# Altium project TMDX654GPEVM.PrjPcb (part 4 of 24)

## Sheet 17-eMMC FLASH_SDCARD INTERFACE.SchDoc
size 513 x 386 mm
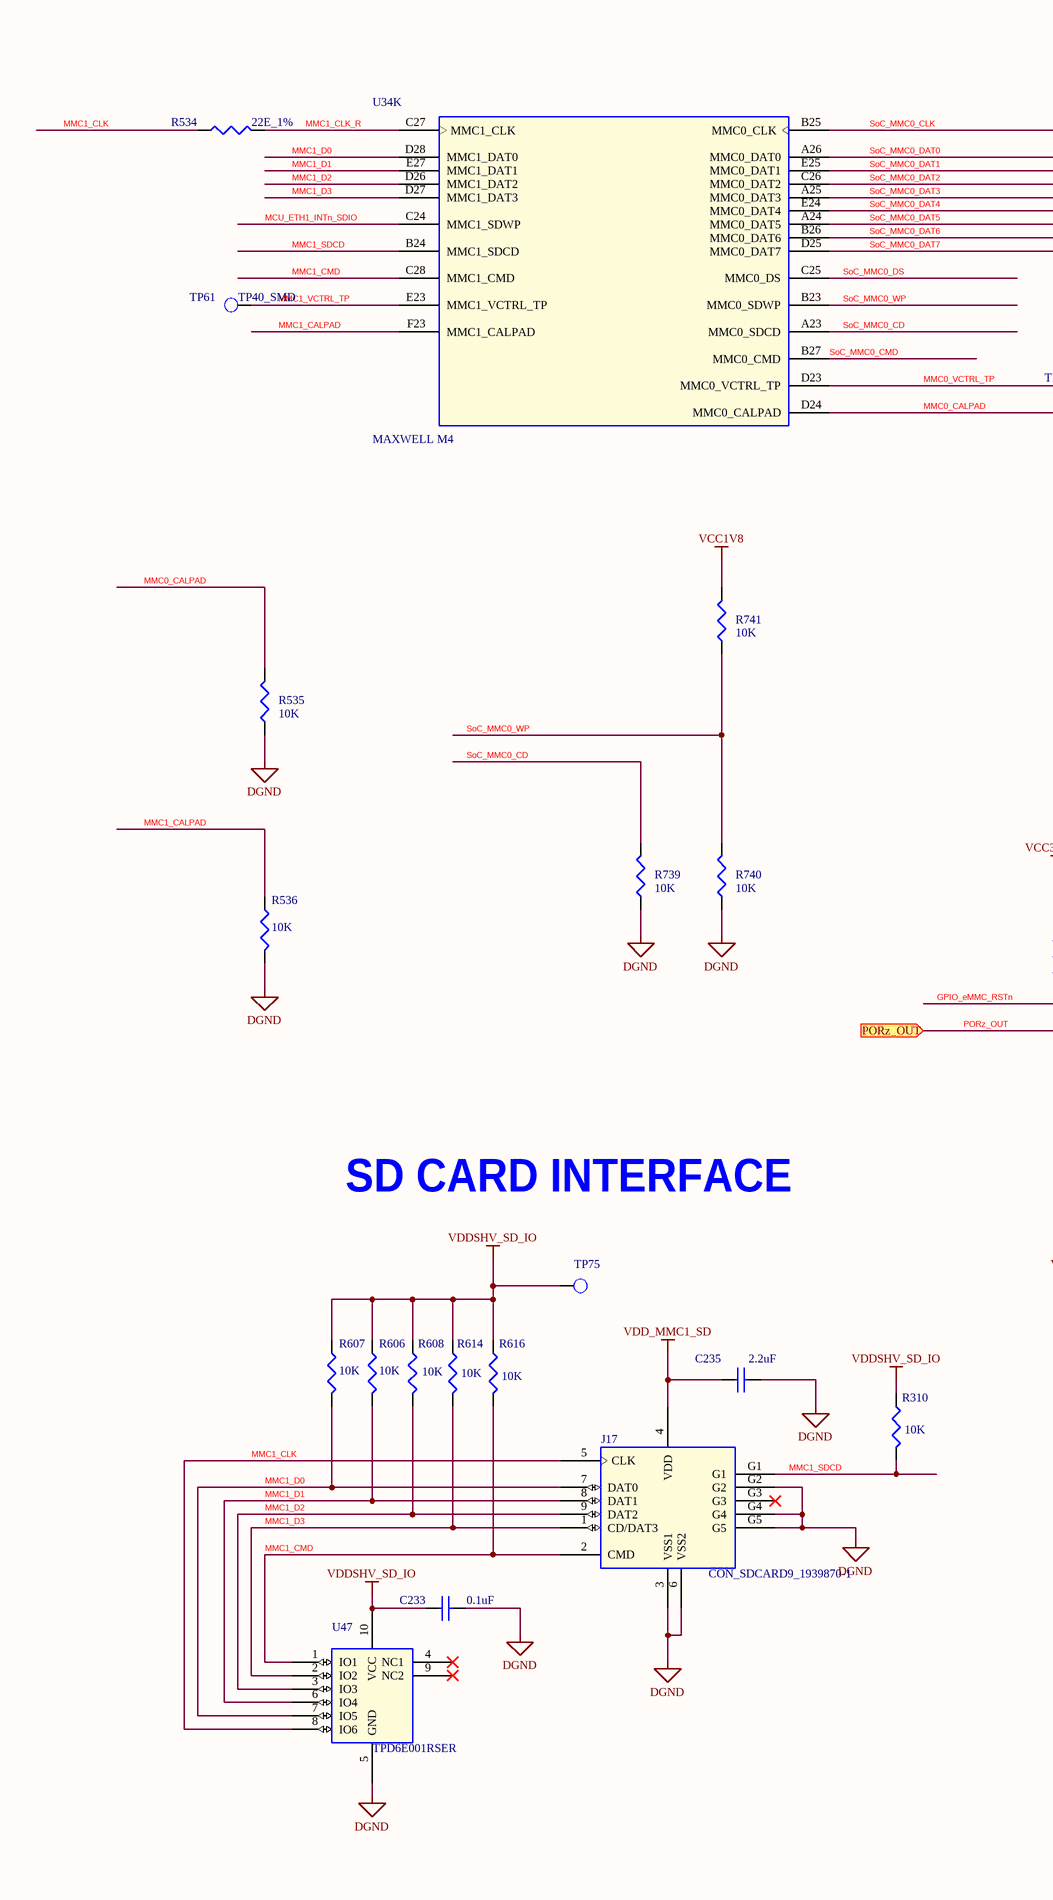
[diagram p26: 17-eMMC FLASH_SDCARD INTERFACE.SchDoc, left]
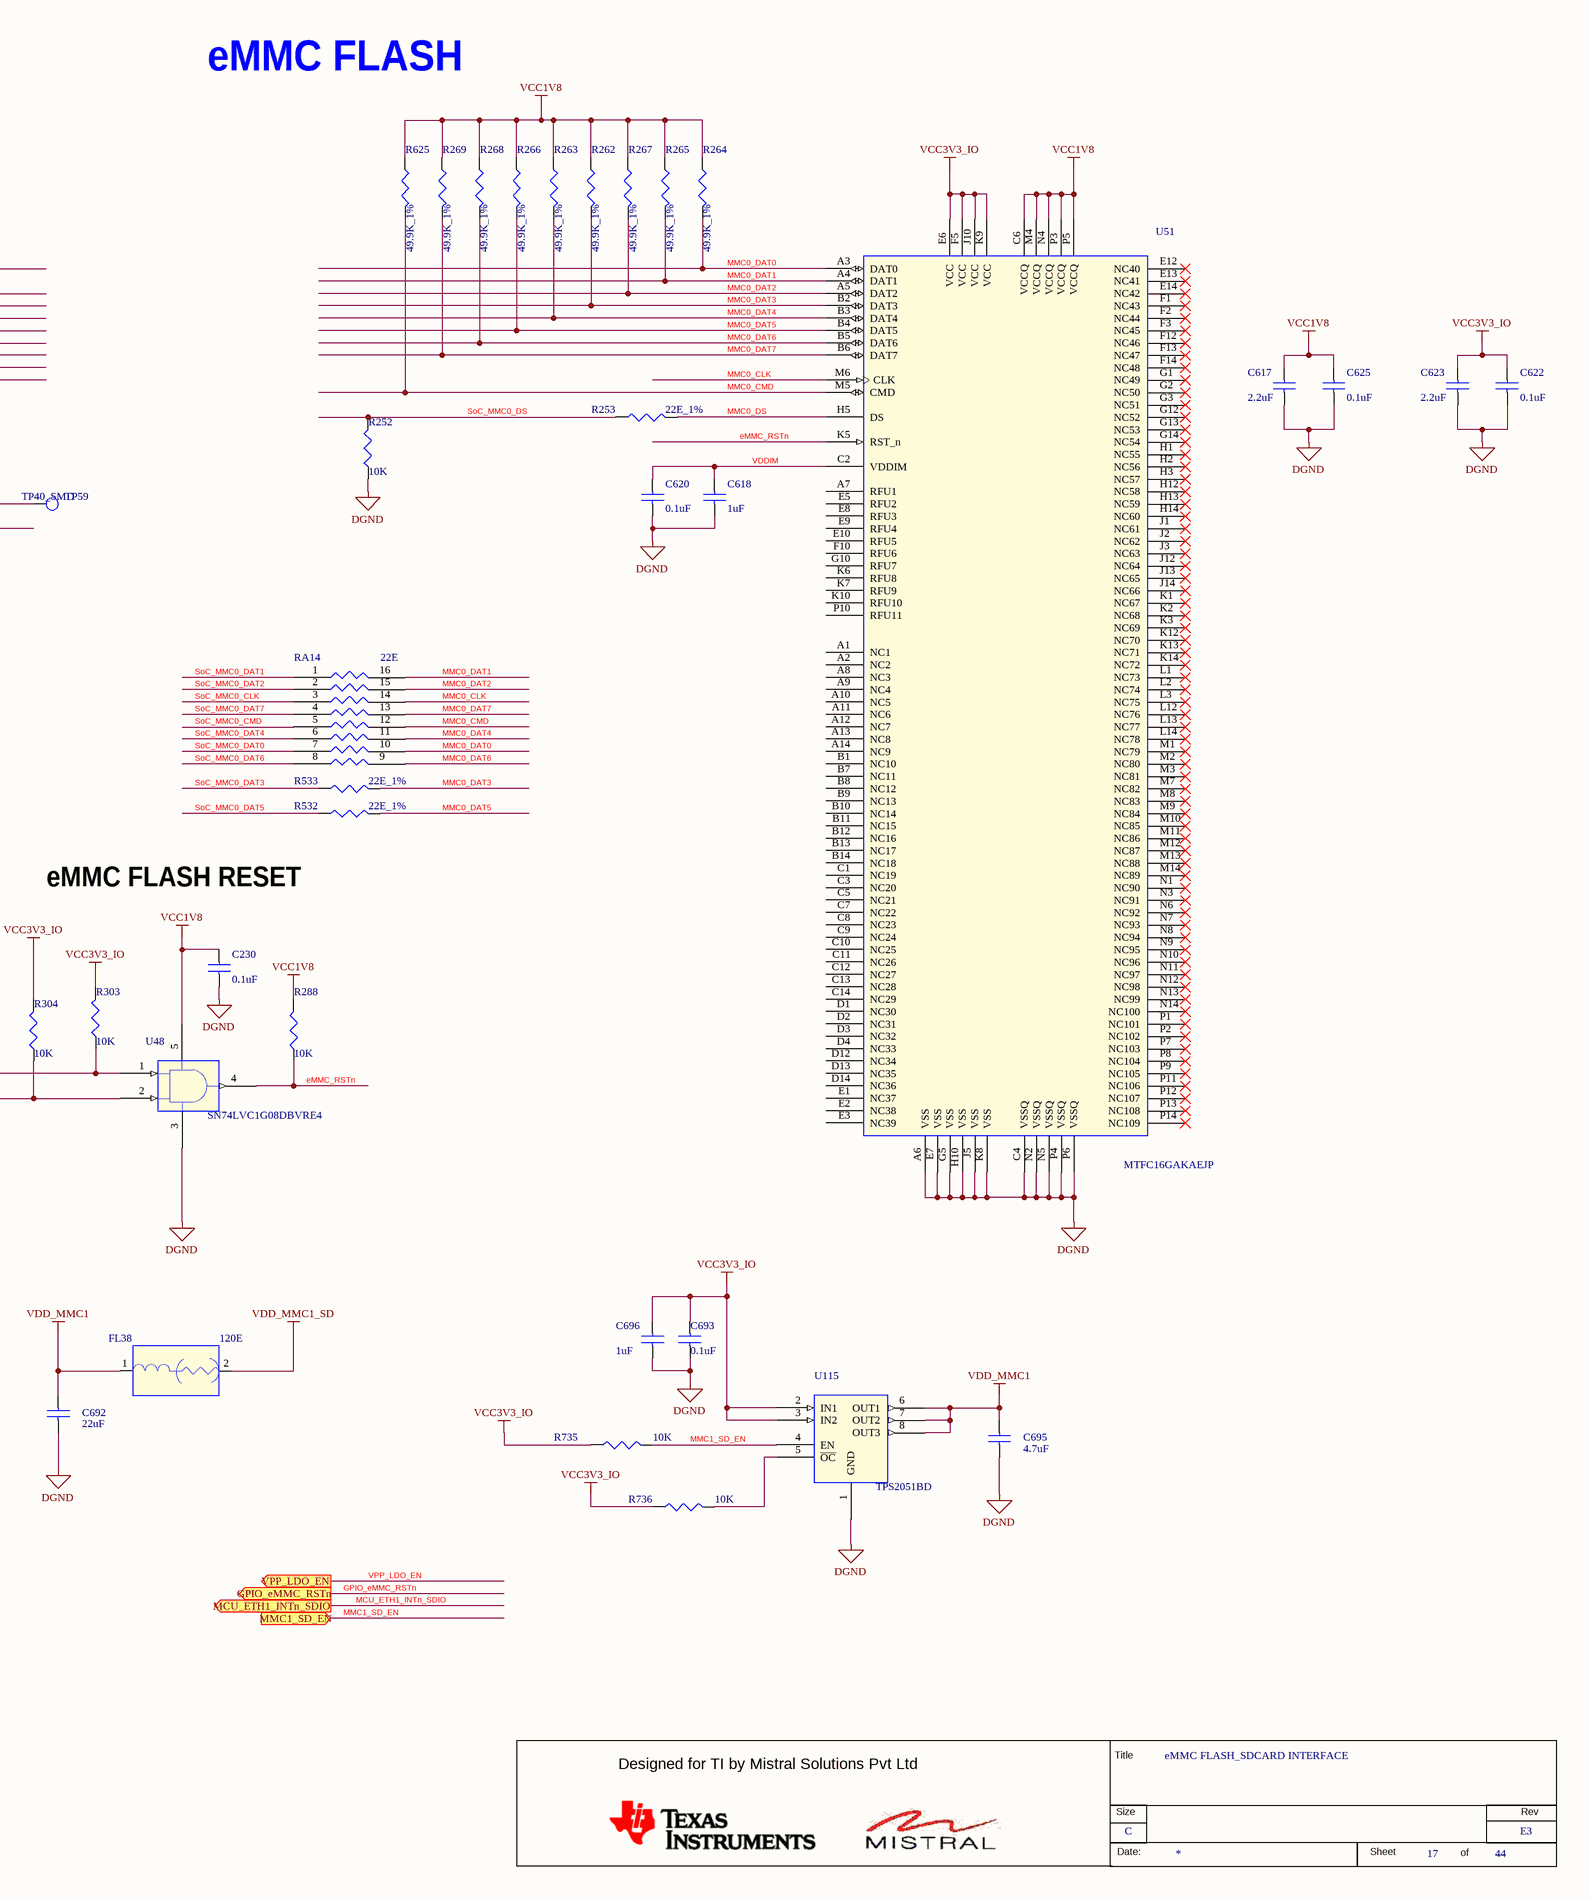
[diagram p27: 17-eMMC FLASH_SDCARD INTERFACE.SchDoc, right]

### Parts
(Parts that share a designator on the sheet are numbered #1, #2 ... from top to bottom, then left to right.)
*#17  RevCode: E3  Title: eMMC FLASH_SDCARD INTERFACE  Page Size: C  Page Number: 17  Page Count: 44  (hidden comment: MISTRAL_TITLEBLK_CSIZE)  (graphical)
C230  0.1uF  [CAP0201_0-5]
C233  0.1uF  [CAP0201_0-5]
C235  2.2uF  [CAP0402_0-75]
C617  2.2uF  [CAP0402_0-75]
C618  1uF  [CAP0402_0-75]
C620  0.1uF  [CAP0201_0-5]
C622  0.1uF  [CAP0201_0-5]
C623  2.2uF  [CAP0402_0-75]
C625  0.1uF  [CAP0201_0-5]
C692  22uF  [CAP1206_2]
C693  0.1uF  [CAP0201_0-5]
C695  4.7uF  [CAP0402_0-75]
C696  1uF  [CAP0402_0-75]
FL38  120E  [EMIFIL_BLM15A_0402_0-6]
J17  CON_SDCARD9_1939870-1  [CON_SD9_1939870-1_S_R_S_2-9]
R252  10K  [RES0402_0-5]
R253  22E_1%  [RES0402]
R262  49.9K_1%  [RES0402]
R263  49.9K_1%  [RES0402]
R264  49.9K_1%  [RES0402]
R265  49.9K_1%  [RES0402]
R266  49.9K_1%  [RES0402]
R267  49.9K_1%  [RES0402]
R268  49.9K_1%  [RES0402]
R269  49.9K_1%  [RES0402]
R288  10K  [RES0402_0-5]
R303  10K  [RES0402_0-5]
R304  10K  [RES0402_0-5]
R310  10K  [RES0402_0-5]
R532  22E_1%  [RES0402]
R533  22E_1%  [RES0402]
R534  22E_1%  [RES0402]
R535  10K  [RES0402_0-5]
R536  10K  [RES0402_0-5]
R606  10K  [RES0402_0-5]
R607  10K  [RES0402_0-5]
R608  10K  [RES0402_0-5]
R614  10K  [RES0402_0-5]
R616  10K  [RES0402_0-5]
R625  49.9K_1%  [RES0402]
R735  10K  [RES0402_0-5]
R736  10K  [RES0402_0-5]
R739  10K  [RES0402_0-5]
R740  10K  [RES0402_0-5]
R741  10K  [RES0402_0-5]
RA14  22E  [RESA_0402-8]
TP59  TP40_SMD  [TP40_SMD]
TP61  TP40_SMD  [TP40_SMD]
TP75  TP40_SMD  [TP40_SMD]  (value not drawn)
U34  MAXWELL M4  [BGA784_31-49_910X910_1-7]  (part K of 19)
U47  TPD6E001RSER  [UQFN10_19-68_80X60_0-6]
U48  SN74LVC1G08DBVRE4  [SOT23-5]
U51  MTFC16GAKAEJP  [VFBGA153_19-68_460X520_1-2]
U115  TPS2051BD  [SOIC8_1-8]

### Ports
GPIO_eMMC_RSTn (out), MCU_ETH1_INTn_SDIO (out), MMC1_SD_EN (in), PORz_OUT (in), VPP_LDO_EN (out)

### Nets
DGND: C230.2 C233.2 C235.2 C617.2 C618.2 C620.2 C622.2 C623.2 C625.2 C692.2 C693.2 C695.2 C696.2 J17.3(VSS1) J17.6(VSS2) J17.G2 J17.G4 J17.G5 R252.1 R535.2 R536.2 R739.2 R740.2 U47.5(GND) U48.3(GND) U51.A6(VSS) U51.C4(VSSQ) U51.E7(VSS) U51.G5(VSS) U51.H10(VSS) U51.J5(VSS) U51.K8(VSS) U51.N2(VSSQ) U51.N5(VSSQ) U51.P4(VSSQ) U51.P6(VSSQ) U115.1(GND)
VCC1V8: C230.1 C617.1 C625.1 R262.1 R263.1 R264.1 R265.1 R266.1 R267.1 R268.1 R269.1 R288.2 R625.1 R741.1 U48.5(VCC) U51.C6(VCCQ) U51.M4(VCCQ) U51.N4(VCCQ) U51.P3(VCCQ) U51.P5(VCCQ)
VCC3V3_IO: C622.1 C623.1 C693.1 C696.1 R303.2 R304.2 R735.1 R736.1 U51.E6(VCC) U51.F5(VCC) U51.J10(VCC) U51.K9(VCC) U115.2(IN1) U115.3(IN2)
VDD_MMC1: C692.1 C695.1 FL38.1 U115.6(OUT1) U115.7(OUT2) U115.8(OUT3)
VDD_MMC1_SD: C235.1 FL38.2 J17.4(VDD)
VDDSHV_SD_IO: C233.1 R310.1 R606.1 R607.1 R608.1 R614.1 R616.1 TP75.1(TP) U47.10(VCC)
eMMC_RSTn: R288.1 U48.4(Y) U51.K5(RST_n)
GPIO_eMMC_RSTn: R303.1 U48.1(A) ; port GPIO_eMMC_RSTn
MCU_ETH1_INTn_SDIO: U34.C24(MMC1_SDWP) ; port MCU_ETH1_INTn_SDIO
MMC0_CALPAD: R535.1 U34.D24(MMC0_CALPAD)
MMC0_CLK: RA14.14 U51.M6(CLK)
MMC0_CMD: R625.2 RA14.12 U51.M5(CMD)
MMC0_DAT0: R264.2 RA14.10 U51.A3(DAT0)
MMC0_DAT1: R265.2 RA14.16 U51.A4(DAT1)
MMC0_DAT2: R267.2 RA14.15 U51.A5(DAT2)
MMC0_DAT3: R262.2 R533.2 U51.B2(DAT3)
MMC0_DAT4: R263.2 RA14.11 U51.B3(DAT4)
MMC0_DAT5: R266.2 R532.2 U51.B4(DAT5)
MMC0_DAT6: R268.2 RA14.9 U51.B5(DAT6)
MMC0_DAT7: R269.2 RA14.13 U51.B6(DAT7)
MMC0_DS: R253.2 U51.H5(DS)
MMC0_VCTRL_TP: TP59.1(TP) U34.D23(MMC0_VCTRL_TP)
MMC1_CALPAD: R536.1 U34.F23(MMC1_CALPAD)
MMC1_CLK: J17.5(CLK) R534.1 U47.8(IO6)
MMC1_CLK_R: R534.2 U34.C27(MMC1_CLK)
MMC1_CMD: J17.2(CMD) R616.2 U34.C28(MMC1_CMD) U47.1(IO1)
MMC1_D0: J17.7(DAT0) R607.2 U34.D28(MMC1_DAT0) U47.7(IO5)
MMC1_D1: J17.8(DAT1) R606.2 U34.E27(MMC1_DAT1) U47.6(IO4)
MMC1_D2: J17.9(DAT2) R608.2 U34.D26(MMC1_DAT2) U47.3(IO3)
MMC1_D3: J17.1(CD/DAT3) R614.2 U34.D27(MMC1_DAT3) U47.2(IO2)
MMC1_SD_EN: R735.2 U115.4(EN) ; port MMC1_SD_EN
MMC1_SDCD: J17.G1 R310.2 U34.B24(MMC1_SDCD)
MMC1_VCTRL_TP: TP61.1(TP) U34.E23(MMC1_VCTRL_TP)
PORz_OUT: R304.1 U48.2(B) ; port PORz_OUT
SoC_MMC0_CD: R739.1 U34.A23(MMC0_SDCD)
SoC_MMC0_CLK: RA14.3 U34.B25(MMC0_CLK)
SoC_MMC0_CMD: RA14.5 U34.B27(MMC0_CMD)
SoC_MMC0_DAT0: RA14.7 U34.A26(MMC0_DAT0)
SoC_MMC0_DAT1: RA14.1 U34.E25(MMC0_DAT1)
SoC_MMC0_DAT2: RA14.2 U34.C26(MMC0_DAT2)
SoC_MMC0_DAT3: R533.1 U34.A25(MMC0_DAT3)
SoC_MMC0_DAT4: RA14.6 U34.E24(MMC0_DAT4)
SoC_MMC0_DAT5: R532.1 U34.A24(MMC0_DAT5)
SoC_MMC0_DAT6: RA14.8 U34.B26(MMC0_DAT6)
SoC_MMC0_DAT7: RA14.4 U34.D25(MMC0_DAT7)
SoC_MMC0_DS: R252.2 R253.1 U34.C25(MMC0_DS)
SoC_MMC0_WP: R740.1 R741.2 U34.B23(MMC0_SDWP)
VDDIM: C618.1 C620.1 U51.C2(VDDIM)
NetR736_2: R736.2 U115.5(~{OC})

Not connected (* = marked no-connect by the designer): J17 G3*; U47 4(NC1)* 9(NC2)*; U51 A1(NC1) A2(NC2) A7(RFU1) A8(NC3) A9(NC4) A10(NC5) A11(NC6) A12(NC7) A13(NC8) A14(NC9) B1(NC10) B7(NC11) B8(NC12) B9(NC13) B10(NC14) B11(NC15) B12(NC16) B13(NC17) B14(NC18) C1(NC19) C3(NC20) C5(NC21) C7(NC22) C8(NC23) C9(NC24) C10(NC25) C11(NC26) C12(NC27) C13(NC28) C14(NC29) D1(NC30) D2(NC31) D3(NC32) D4(NC33) D12(NC34) D13(NC35) D14(NC36) E1(NC37) E2(NC38) E3(NC39) E5(RFU2) E8(RFU3) E9(RFU4) E10(RFU5) E12(NC40)* E13(NC41)* E14(NC42)* F1(NC43)* F2(NC44)* F3(NC45)* F10(RFU6) F12(NC46)* F13(NC47)* F14(NC48)* G1(NC49)* G2(NC50)* G3(NC51)* G10(RFU7) G12(NC52)* G13(NC53)* G14(NC54)* H1(NC55)* H2(NC56)* H3(NC57)* H12(NC58)* H13(NC59)* H14(NC60)* J1(NC61)* J2(NC62)* J3(NC63)* J12(NC64)* J13(NC65)* J14(NC66)* K1(NC67)* K2(NC68)* K3(NC69)* K6(RFU8) K7(RFU9) K10(RFU10) K12(NC70)* K13(NC71)* K14(NC72)* L1(NC73)* L2(NC74)* L3(NC75)* L12(NC76)* L13(NC77)* L14(NC78)* M1(NC79)* M2(NC80)* M3(NC81)* M7(NC82)* M8(NC83)* M9(NC84)* M10(NC85)* M11(NC86)* M12(NC87)* M13(NC88)* M14(NC89)* N1(NC90)* N3(NC91)* N6(NC92)* N7(NC93)* N8(NC94)* N9(NC95)* N10(NC96)* N11(NC97)* N12(NC98)* N13(NC99)* N14(NC100)* P1(NC101)* P2(NC102)* P7(NC103)* P8(NC104)* P9(NC105)* P10(RFU11) P11(NC106)* P12(NC107)* P13(NC108)* P14(NC109)*

### Notes on the sheet
- eMMC FLASH
- eMMC FLASH RESET
- SD CARD INTERFACE
- (in symbol MISTRAL_TITLEBLK_CSIZE) Title; Designed for TI by Mistral Solutions Pvt Ltd; Size; Rev; Date:; Sheet; of

### Library data of the parts
*#17 = MISTRAL_TITLEBLK_CSIZE: Issue: 1.0; Page Create Date: March  8, 1995; Page Modify Date: *
C230 C620 C622 C625 = CAP_Dup5: CAP CERAMIC 0.1uF 16V 10% X5R 0201; Mistral Part No: 120009030072-R; Mfr_name: MURATA; Mfr_part_number: GRM033R61C104KE84J; Part_type: CAPACITORS\CERAMIC; Project: TI_MAXIE_CPB; Wattage: NA; Customs_HS_Code: 85322990; Custom_Duty: 15%; Tolerance: 10%; Voltage: 16V; Package: 0201; Distributor_name: DIGIKEY; Distributor_part_number: 490-16742-1-ND; Height: 0.33MM; Weight: 0.33mg; Temperature: -55°C+85°C; Datasheet: Y:\MIS_DATABASE\DATASHEETS\CAPACITORS\GRM033R61C104KE84.PDF; Crtd /date: MANIRAJA/120218; Chkd/date: MANIRAJA/120218; MECHANICAL 3D STEP FILE: CAP0201_0-5; Library Ref: CAP; PCB Footprint: CAP0201_0-5
C233 C693 = CAP_Dup5: CAP CERAMIC 0.1uF 16V 10% X5R 0201; Part_type: CAPACITORS\CERAMIC; Mfr_part_number: GRM033R61C104KE84J; Mfr_name: MURATA; Mistral Part No: 120009030072-R; Custom_Duty: 15%; Customs_HS_Code: 85322990; Wattage: NA; Project: TI_MAXIE_CPB; Library Ref: CAP; MECHANICAL 3D STEP FILE: CAP0201_0-5; Chkd/date: MANIRAJA/120218; Crtd /date: MANIRAJA/120218; Datasheet: Y:\MIS_DATABASE\DATASHEETS\CAPACITORS\GRM033R61C104KE84.PDF; Temperature: -55°C+85°C; Weight: 0.33mg; Height: 0.33MM; Distributor_part_number: 490-16742-1-ND; Distributor_name: DIGIKEY; Package: 0201; Voltage: 16V; Tolerance: 10%; PCB Footprint: CAP0201_0-5
C235 C617 C623 = CAP_Dup5: CAP CERAMIC 2.2uF 10V 20% X5R 0402; Mistral Part No: 120018010016-R; Mfr_name: MURATA; Mfr_part_number: GRT155R61A225ME01D; Part_type: CAPACITORS\CERAMIC; Project: TI_MAXIE_CPB; Wattage: NA; Customs_HS_Code: 85322990; Custom_Duty: 15%; PCB Footprint: CAP0402_0-75; Tolerance: 20%; Voltage: 10V; Package: 0402; Distributor_name: DIGIKEY; Distributor_part_number: 490-12254-1-ND; Library Ref: CAP; Height: 0.55MM; Weight: 0.65mg; Temperature: -55°C+85°C; Datasheet: Y:\MIS_DATABASE\DATASHEETS\CAPACITORS\GRT155R61A225ME01.PDF; Crtd /date: MANIRAJA/240118; Chkd/date: MANIRAJA/240118; MECHANICAL 3D STEP FILE: CAP0402_0-75
C618 = CAP_Dup5: CAP CERAMIC 1uF 16V 20% X5R 0402; Part_type: CAPACITORS\CERAMIC; Mfr_part_number: EMK105BJ105MV-F; Mfr_name: TAIYO YUDEN; Mistral Part No: 120018020006-R; Custom_Duty: 15%; Customs_HS_Code: 85322990; Project: TI_MAXIE_CPB; Wattage: NA; Footprint Ref: CAP0402_0-75; Library Ref: CAP; Chkd/date: MANIRAJA/150218; Crtd /date: ALVY/150218; Datasheet: Y:\MIS_DATABASE\DATASHEETS\CAPACITORS\EMK105BJ105MV-F.PDF; Temperature: -55°C+85°C; Weight: 0.65mg; Height: 0.55MM; Distributor_part_number: 587-5514-1-ND; Distributor_name: DIGIKEY; Package: 0402; Voltage: 16V; Tolerance: 20%; PCB Footprint: CAP0402_0-75; MECHANICAL 3D STEP FILE: CAP0402_0-75; Library Path: Y:\MIS_DATABASE\Library\ALTIUM_TOOL\SCHEMATICS_PARTS\MS_DISCRETE_Library.schlib; Footprint Path: Y:\MIS_DATABASE\Library\ALTIUM_TOOL\PCB_FOOTPRINTS\Altium_Footprint_Lib.PcbLib
C692 = CAP_Dup5: CAP CERAMIC 22uF 16V 20% X7R 1206; Part_type: CAPACITORS\CERAMIC; Mfr_part_number: EMK316BB7226ML-T; Mfr_name: TAIYO YUDEN; Mistral Part No: 120017010003-R; Custom_Duty: 15%; Customs_HS_Code: 85322990; Wattage: NA; Project: TRMM_SMART-M_PS; MECHANICAL 3D STEP FILE: CAP1206_2; Chkd/date: VASANTHA/170117; Crtd /date: VASANTHA/170117; Datasheet: Y:\MIS_DATABASE\DATASHEETS\CAPACITORS\EMK316BB7226ML.PDF; Temperature: -55°C+125°C; Weight: 16.2mg; Height: 1.90MM; Library Ref: CAP; Distributor_part_number: 587-4319-1-ND; Distributor_name: DIGIKEY; Package: 1206; Voltage: 16V; Tolerance: 20%; PCB Footprint: CAP1206_2
C695 = CAP_Dup5: CAP CERAMIC 4.7uF 10V 20% X5R 0402; Mistral Part No: 120012060002-R; Mfr_name: AVX CORPORATION; Mfr_part_number: 0402ZD475MAT2A; Part_type: CAPACITORS\CERAMIC; Project: TI_MAXIE_CPB; Wattage: NA; Customs_HS_Code: 85322990; Custom_Duty: 15%; PCB Footprint: CAP0402_0-75; Tolerance: 20%; Voltage: 10V; Package: 0402; Distributor_name: DIGIKEY; Distributor_part_number: 478-10791-1-ND; Height: 0.71MM; Weight: 0.65mg; Temperature: -55°C+85°C; Datasheet: Y:\MIS_DATABASE\DATASHEETS\CAPACITORS\AVX_MLC.PDF; Crtd /date: MANIRAJA/230118; Chkd/date: MANIRAJA/230118; MECHANICAL 3D STEP FILE: CAP0402_0-75; Library Ref: CAP
C696 = CAP_Dup5: CAP CERAMIC 1uF 16V 20% X5R 0402; Part_type: CAPACITORS\CERAMIC; Mfr_part_number: EMK105BJ105MV-F; Mfr_name: TAIYO YUDEN; Mistral Part No: 120018020006-R; Custom_Duty: 15%; Customs_HS_Code: 85322990; Wattage: NA; Project: TI_MAXIE_CPB; PCB Footprint: CAP0402_0-75; Footprint Path: Y:\MIS_DATABASE\Library\ALTIUM_TOOL\PCB_FOOTPRINTS\Altium_Footprint_Lib.PcbLib; Library Path: Y:\MIS_DATABASE\Library\ALTIUM_TOOL\SCHEMATICS_PARTS\MS_DISCRETE_Library.schlib; MECHANICAL 3D STEP FILE: CAP0402_0-75; Chkd/date: MANIRAJA/150218; Crtd /date: ALVY/150218; Datasheet: Y:\MIS_DATABASE\DATASHEETS\CAPACITORS\EMK105BJ105MV-F.PDF; Temperature: -55°C+85°C; Weight: 0.65mg; Height: 0.55MM; Library Ref: CAP; Distributor_part_number: 587-5514-1-ND; Distributor_name: DIGIKEY; Package: 0402; Voltage: 16V; Tolerance: 20%; Footprint Ref: CAP0402_0-75
FL38 = EMIFILTER_IND: FERRITE CHIP 120E 1.3A 0402; Part_type: MISC\FILTER; Mfr_part_number: BLM15PD121SN1; Mfr_name: MURATA; Mistral Part No: 130012030043-R; Custom_Duty: 24%; Customs_HS_Code: 85437099; Wattage: NA; Tolerance: 25%; Project: GEN_3-8; Footprint Path: Y:\MIS_DATABASE\Library\ALTIUM_TOOL\PCB_FOOTPRINTS\Altium_Footprint_Lib.PcbLib; Library Path: Y:\MIS_DATABASE\Library\ALTIUM_TOOL\SCHEMATICS_PARTS\MS_FILTER_Library.schlib; MECHANICAL 3D STEP FILE: EMIFIL_BLM15A_0402_0-6; Chkd/date: VASANTHA/010117; Crtd /date: CHAITHANYA/150312; Datasheet: Y:\MIS_DATABASE\DATASHEETS\DISCRETES\INDUCTORS\BLM18K-SERIES.PDF; Temperature: -55°C+125°C; Weight: 0.65mg; Height: 0.55MM; Footprint Ref: EMIFIL_BLM15A_0402_0-6; Library Ref: EMIFILTER_IND; Distributor_part_number: 490-5203-1-ND; Distributor_name: DIGIKEY; Package: 0402; Voltage: NA; PCB Footprint: EMIFIL_BLM15A_0402_0-6
J17 = CON_SDCARD9_1939870-1: CON SD CARD PUSH-PUSH 9POS RT SMD; Mistral Part No: 150017100004-R; Mfr_name: TE CONNECTIVITY; Part_type: CONNECTOR\MEMORY CARD; Project: TI_MAXIE_CPB; Tolerance: NA; Customs_HS_Code: 85369090; Custom_Duty: 24%; MECHANICAL 3D STEP FILE: CON_SD9_1939870-1_S_R_S_3-4; Library Ref: CON_SDCARD9_1939870-1; Mfr_part_number: 1939870-1; Voltage: NA; Wattage: NA; Package: SMD; Distributor_name: DIGIKEY; Distributor_part_number: A118090CT-ND; Height: 2.90MM; Weight: NA; Temperature: NA; Datasheet: Y:\MIS_DATABASE\DATASHEETS\CONNECTORS\1939870-XX.PDF; Crtd /date: MANIRAJA/051017; Chkd/date: MANIRAJA/051017; PCB Footprint: CON_SD9_1939870-1_S_R_S_2-9
R252 R288 R310 R535 R608 R614 R736 R739 R740 = RESISTOR_Dup5: as R516 on sheet 16-DDR4 ECC AND TERMINATIONS; Footprint Path: Y:\MIS_DATABASE\Library\ALTIUM_TOOL\PCB_FOOTPRINTS\Altium_Footprint_Lib.PcbLib; Library Path: Y:\MIS_DATABASE\Library\ALTIUM_TOOL\SCHEMATICS_PARTS\MS_DISCRETE_Library.schlib; Footprint Ref: RES0402_0-5; Library Ref: RESISTOR; MECHANICAL 3D STEP FILE: RES0402_0-5; RoHS: Pb-Free; Chkd/date: VASANTHA/061216; Crtd /date: MAZHAR/230805; Datasheet: Y:\MIS_DATABASE\DATASHEETS\RESISTORS\YAGEO-RC0402.PDF; Temperature: -55°C+155°C; Weight: 0.65mg; Height: 0.40MM; Distributor_part_number: 311-10KJRCT-ND; Distributor_name: DIGIKEY; Package: 0402; Wattage: 1/16W; Tolerance: 5%; PCB Footprint: RES0402_0-5
R253 R532 R533 = RESISTOR_Dup4: RES 22E 1/16W 1% 0402; Cust_part_number: 4700-80047E; Alternate_mfr_part_number_A: CRCW040222R0FKED; Alternate_mfr_name_A: VISHAY; Part_type: RESISTORS\FIXED; Mfr_part_number: RC0402FR-0722RL; Mfr_name: YAGEO AMERICA; Mistral Part No: 110009090004-P; Remarks: In alternate datasheet it is RoHS COMPLIANT. Y:\MIS_DATABASE\DATASHEETS\RESISTORS\CRCW0402.PDF; Custom_Duty: 15%; Customs_HS_Code: 85332119; Voltage: 50V; Project: VMEFMCD; SIGNAL_MODEL: RESISTOR_RES0402_22E_22E; Library Ref: RESISTOR; RoHS: Pb-Free; Chkd/date: SUHAS/290910; Crtd /date: MAZHAR/090909; Datasheet: Y:\MIS_DATABASE\DATASHEETS\RESISTORS\YAGEO-RC0402.PDF; Temperature: -55°C+155°C; Weight: 0.8g/1000pcs; Height: 0.40MM; Distributor_part_number_A: 541-22.0LCT-ND; Distributor_name_A: DIGIKEY; Distributor_part_number: 311-22.0LRCT-ND; Distributor_name: DIGIKEY; Package: 0402; Wattage: 1/16W; Tolerance: 1%; PCB Footprint: RES0402
R262 R266 R267 R269 = RESISTOR_Dup5: RES 49.9K1/16W 1% 0402; Part_type: RESISTORS\FIXED; Mfr_part_number: RC0402FR-0749K9L; Mfr_name: YAGEO AMERICA; Mistral Part No: 110009030904-P; Custom_Duty: 15%; Customs_HS_Code: 85332119; Wattage: 1/16W; Project: PNAV; NI_MARK: DNI; Library Ref: RESISTOR; RoHS: Pb-Free; Chkd/date: MAZHAR/220709; Crtd /date: GEETHA/090606; Datasheet: Y:\MIS_DATABASE\DATASHEETS\RESISTORS\YAGEO-RC0402.PDF; Height: 0.40MM; Distributor_part_number: 311-49.9KLRCT-ND; Distributor_name: DIGIKEY; Package: 0402; Tolerance: 1%; PCB Footprint: RES0402
R263-R265 R268 R625 = RESISTOR_Dup5: RES 49.9K1/16W 1% 0402; Mistral Part No: 110009030904-P; Mfr_name: YAGEO AMERICA; Mfr_part_number: RC0402FR-0749K9L; Part_type: RESISTORS\FIXED; Project: PNAV; Wattage: 1/16W; Customs_HS_Code: 85332119; Custom_Duty: 15%; NI_MARK: DNI; Library Ref: RESISTOR; Tolerance: 1%; Package: 0402; Distributor_name: DIGIKEY; Distributor_part_number: 311-49.9KLRCT-ND; Height: 0.40MM; Datasheet: Y:\MIS_DATABASE\DATASHEETS\RESISTORS\YAGEO-RC0402.PDF; Crtd /date: GEETHA/090606; Chkd/date: MAZHAR/220709; RoHS: Pb-Free; PCB Footprint: RES0402
R303 R304 R536 R606 R607 R616 R735 = RESISTOR_Dup5: as R460 on sheet 16-DDR4 ECC AND TERMINATIONS; Tolerance: 5%; Wattage: 1/16W; Package: 0402; Distributor_name: DIGIKEY; Distributor_part_number: 311-10KJRCT-ND; Height: 0.40MM; Weight: 0.65mg; Temperature: -55°C+155°C; Datasheet: Y:\MIS_DATABASE\DATASHEETS\RESISTORS\YAGEO-RC0402.PDF; Crtd /date: MAZHAR/230805; Chkd/date: VASANTHA/061216; RoHS: Pb-Free; MECHANICAL 3D STEP FILE: RES0402_0-5; Library Ref: RESISTOR; Footprint Ref: RES0402_0-5; Library Path: Y:\MIS_DATABASE\Library\ALTIUM_TOOL\SCHEMATICS_PARTS\MS_DISCRETE_Library.schlib; Footprint Path: Y:\MIS_DATABASE\Library\ALTIUM_TOOL\PCB_FOOTPRINTS\Altium_Footprint_Lib.PcbLib; PCB Footprint: RES0402_0-5
R534 = RESISTOR_Dup5: RES 22E 1/16W 1% 0402; Mistral Part No: 110009090004-P; Mfr_name: YAGEO AMERICA; Mfr_part_number: RC0402FR-0722RL; Part_type: RESISTORS\FIXED; Alternate_mfr_name_A: VISHAY; Alternate_mfr_part_number_A: CRCW040222R0FKED; Cust_part_number: 4700-80047E; Project: VMEFMCD; Voltage: 50V; Customs_HS_Code: 85332119; Custom_Duty: 15%; Remarks: In alternate datasheet it is RoHS COMPLIANT. Y:\MIS_DATABASE\DATASHEETS\RESISTORS\CRCW0402.PDF; Library Ref: RESISTOR; Tolerance: 1%; Wattage: 1/16W; Package: 0402; Distributor_name: DIGIKEY; Distributor_part_number: 311-22.0LRCT-ND; Distributor_name_A: DIGIKEY; Distributor_part_number_A: 541-22.0LCT-ND; Height: 0.40MM; Weight: 0.8g/1000pcs; Temperature: -55°C+155°C; Datasheet: Y:\MIS_DATABASE\DATASHEETS\RESISTORS\YAGEO-RC0402.PDF; Crtd /date: MAZHAR/090909; Chkd/date: SUHAS/290910; RoHS: Pb-Free; PCB Footprint: RES0402
R741 = RESISTOR_Dup5: RES 10K 1/16W 5% 0402; Part_type: RESISTORS\FIXED; Mfr_part_number: RC0402JR-0710KL; Mfr_name: YAGEO AMERICA; Mistral Part No: 110009030208-R; Custom_Duty: 15%; Customs_HS_Code: 85332119; Voltage: NA; Project: HSE; NI_MARK: DNI; Footprint Path: Y:\MIS_DATABASE\Library\ALTIUM_TOOL\PCB_FOOTPRINTS\Altium_Footprint_Lib.PcbLib; Library Path: Y:\MIS_DATABASE\Library\ALTIUM_TOOL\SCHEMATICS_PARTS\MS_DISCRETE_Library.schlib; Footprint Ref: RES0402_0-5; Library Ref: RESISTOR; MECHANICAL 3D STEP FILE: RES0402_0-5; RoHS: Pb-Free; Chkd/date: VASANTHA/061216; Crtd /date: MAZHAR/230805; Datasheet: Y:\MIS_DATABASE\DATASHEETS\RESISTORS\YAGEO-RC0402.PDF; Temperature: -55°C+155°C; Weight: 0.65mg; Height: 0.40MM; Distributor_part_number: 311-10KJRCT-ND; Distributor_name: DIGIKEY; Package: 0402; Wattage: 1/16W; Tolerance: 5%; PCB Footprint: RES0402_0-5
RA14 = RESARR_ISO8: RES ARRAY 22E 62.5mW 5% 0402; Mistral Part No: 110009030020-R; Mfr_name: CTS; Mfr_part_number: 741X163220JP; Part_type: RESISTORS\ARRAY; SIGNAL_MODEL: RESARR_ISO8_RESA_0402-8_22E_22E; Project: CPB; Wattage: 63mW; Library Ref: RESARR_ISO8; Tolerance: 5%; Package: 0402; Distributor_name: DIGIKEY; Distributor_part_number: 741X163220JPCT-ND; Height: 0.55MM; Datasheet: Y:\MIS_DATABASE\DATASHEETS\RESISTORS\741-6SER.PDF; Crtd /date: USMAN/040908; Chkd/date: MAZHAR/040809; PCB Footprint: RESA_0402-8
TP59 TP61 = TESTPOINT: as TP8 on sheet 15-DDR4 DEVICES; RoHS: NA; Footprint Ref: TP40_SMD; Library Ref: TESTPOINT; Footprint Path: Y:\MIS_DATABASE\Library\ALTIUM_TOOL\PCB_FOOTPRINTS\Altium_Footprint_Lib.PcbLib; Library Path: Y:\MIS_DATABASE\Library\ALTIUM_TOOL\SCHEMATICS_PARTS\MS_DISCRETE_Library.schlib; Datasheet: NA; Temperature: NA; Weight: NA; Wattage: NA; Voltage: NA; Tolerance: NA; Mfr_part_number: TP40_SMD; Part_type: TESTPOINT; Package: SMD; Distributor_name: NA; Distributor_part_number: NA; Height: NA; Crtd /date: MAZHAR/190505; Chkd/date: MAZHAR/190505; PCB Footprint: TP40_SMD
TP75 = TESTPOINT: TESTPOINT CIR 40 SMD; Mistral Part No: 130009030933; Mfr_name: LOCAL; Project: RAINIER-3; Tolerance: NA; NI_MARK: DNI; PCB Footprint: TP40_SMD; Mfr_part_number: TP40_SMD; Part_type: TESTPOINT; Package: SMD; Distributor_name: NA; Distributor_part_number: NA; Height: NA; Crtd /date: MAZHAR/190505; Chkd/date: MAZHAR/190505; Voltage: NA; Wattage: NA; Weight: NA; Temperature: NA; Datasheet: NA; MECHANICAL 3D STEP FILE: NA; Library Path: Y:\MIS_DATABASE\Library\ALTIUM_TOOL\SCHEMATICS_PARTS\MS_DISCRETE_Library.schlib; Footprint Path: Y:\MIS_DATABASE\Library\ALTIUM_TOOL\PCB_FOOTPRINTS\Altium_Footprint_Lib.PcbLib; Library Ref: TESTPOINT; Footprint Ref: TP40_SMD; RoHS: NA
U34 = AM654X_BGA784: IC MAXWELL MICRO CONTROLLER UNIT BGA784; Part_type: ICS\DIGITAL\MICROCONTROLLER; Mfr_part_number: MAXWELL M4_EVM; Mfr_name: TEXAS INSTRUMENTS; Mistral Part No: 141217100003; Custom_Duty: 15%; Customs_HS_Code: 85423100; Wattage: NA; Project: TI_MAXIE_CPB; Library Ref: AM654X_BGA784; PCB Footprint: BGA784_31-49_910X910_1-7; MECHANICAL 3D STEP FILE: BGA784_31-49_910X910_1-7; Chkd/date: MANIRAJA/130717; Crtd /date: MANIRAJA/130717; Datasheet: Y:\MIS_DATABASE\DATASHEETS\ICS\DIGITAL\MICROCONTROLLER\MAXWELLM4.PDF; Temperature: NA; Weight: NA; Height: 1.63MM; Distributor_part_number: NA; Distributor_name: NA; Package: BGA784; Voltage: NA; Tolerance: NA
U47 = TPD6E001RSE_UQFN10: IC 6CH ESD-PROTECTION ARRAY UQFN10; Mistral Part No: 141011080020-R; Mfr_name: TEXAS INSTRUMENTS; Part_type: ICS\INTERFACE; Project: DM385EVM_BASE-BOARD; Tolerance: NA; Customs_HS_Code: 85423100; Custom_Duty: 15%; IBISSP_MODLES: Y:\MIS_DATABASE\IBIS\ICs\INTERFACE\TPD6E001RSE.IBS; Footprint Path: Y:\MIS_DATABASE\Library\ALTIUM_TOOL\PCB_FOOTPRINTS\Altium_Footprint_Lib.PcbLib; Library Path: Y:\MIS_DATABASE\Library\ALTIUM_TOOL\SCHEMATICS_PARTS\MS_MISCINTERFACE_Library.schlib; Footprint Ref: UQFN10_19-68_80X60_0-6; Library Ref: TPD6E001RSE_UQFN10; Mfr_part_number: TPD6E001RSER; Voltage: NA; Wattage: NA; Package: UQFN10; Distributor_name: DIGIKEY; Distributor_part_number: 296-21888-1-ND; Height: 0.60MM; Weight: 7mg; Temperature: -40°C+85°C; Datasheet: Y:\MIS_DATABASE\DATASHEETS\ICS\INTERFACE\TPD6E001.PDF; Crtd /date: BAVISH/160811; Chkd/date: USMAN/070612; MECHANICAL 3D STEP FILE: UQFN10_19-68_80X60_0-6; PCB Footprint: UQFN10_19-68_80X60_0-6
U48 = SN74LVC1G08DBVRE4_SOT23-5: IC SINGLE 2-INPUT POSITIVE AND GATE SOT23-5; Mistral Part No: 141009060026-R; Mfr_name: TEXAS INSTRUMENTS; Part_type: ICS\DIGITAL\GATES; Project: KHAN_MAIN; Customs_HS_Code: 85423100; Custom_Duty: 15%; Mfr_part_number: SN74LVC1G08DBVRE4; Package: SOT23-5; Distributor_name: DIGIKEY; Distributor_part_number: SN74LVC1G08DBVRE4-ND; Height: 1.45MM; Temperature: -40°C+85°C; Datasheet: Y:\MIS_DATABASE\DATASHEETS\ICS\DIGITAL\GATES\SN74LVC1G08.PDF; Crtd /date: USMAN/151008; Chkd/date: SUHAS/221010; RoHS: Sb/ Br FREE; Library Ref: SN74LVC1G08DBVRE4_SOT23-5; PCB Footprint: SOT23-5
U51 = MTFC16GAKAEJP_VFBGA153: IC 16GB E-MMC MEMORY VFBGA153; Mistral Part No: 141118010003-R; Mfr_name: MICRON; Mfr_part_number: MTFC16GAKAEJP-4M IT; Part_type: ICS\DIGITAL\MEMORY; Project: TI_SVB_MAXWELL_DUT; Tolerance: NA; Customs_HS_Code: 85423100; Custom_Duty: 15%; Library Ref: MTFC16GAKAEJP_VFBGA153; Voltage: NA; Wattage: NA; Package: VFBGA153; Distributor_name: DIGIKEY; Distributor_part_number: MTFC16GAKAEJP-4M IT-ND; Height: 1.20MM; Weight: NA; Temperature: -40°C+85°C; Datasheet: Y:\MIS_DATABASE\DATASHEETS\ICS\MEMORY\MTFCXXGAXX.PDF; Crtd /date: MANIRAJA/120118; Chkd/date: MANIRAJA/120118; MECHANICAL 3D STEP FILE: VFBGA153_19-68_460X520_1-2; PCB Footprint: VFBGA153_19-68_460X520_1-2
U115 = TPS2051BD_SOIC8: IC POWER DISTRIBUTION SWITCH SOIC8; Mistral Part No: 142014060011-R; Mfr_name: TEXAS INSTRUMENTS; Part_type: ICS\POWER; Project: AEGIS_POM; Tolerance: NA; Customs_HS_Code: 85423100; Custom_Duty: 15%; PCB Footprint: SOIC8_1-8; Footprint Path: Y:\MIS_DATABASE\Library\ALTIUM_TOOL\PCB_FOOTPRINTS\Altium_Footprint_Lib.PcbLib; Library Path: Y:\MIS_DATABASE\Library\ALTIUM_TOOL\SCHEMATICS_PARTS\MS_MISCPOWER_Library.schlib; MECHANICAL 3D STEP FILE: SOIC8_1-8; Footprint Ref: SOIC8_1-8; Library Ref: TPS2051BD_SOIC8; Mfr_part_number: TPS2051BD; Voltage: NA; Wattage: NA; Package: SOIC8; Distributor_name: DIGIKEY; Distributor_part_number: 296-26911-5-ND; Height: 1.75MM; Weight: 72.6mg; Temperature: -40°C+125°C; Datasheet: Y:\MIS_DATABASE\DATASHEETS\MISC\REGULATORS\TPS2051BDBVR.PDF; Crtd /date: VASANTHA/190614; Chkd/date: NAVEED/150714

## Sheet 18-OSPI FLASH AND SPI NOR FLASH.SchDoc
size 513 x 386 mm
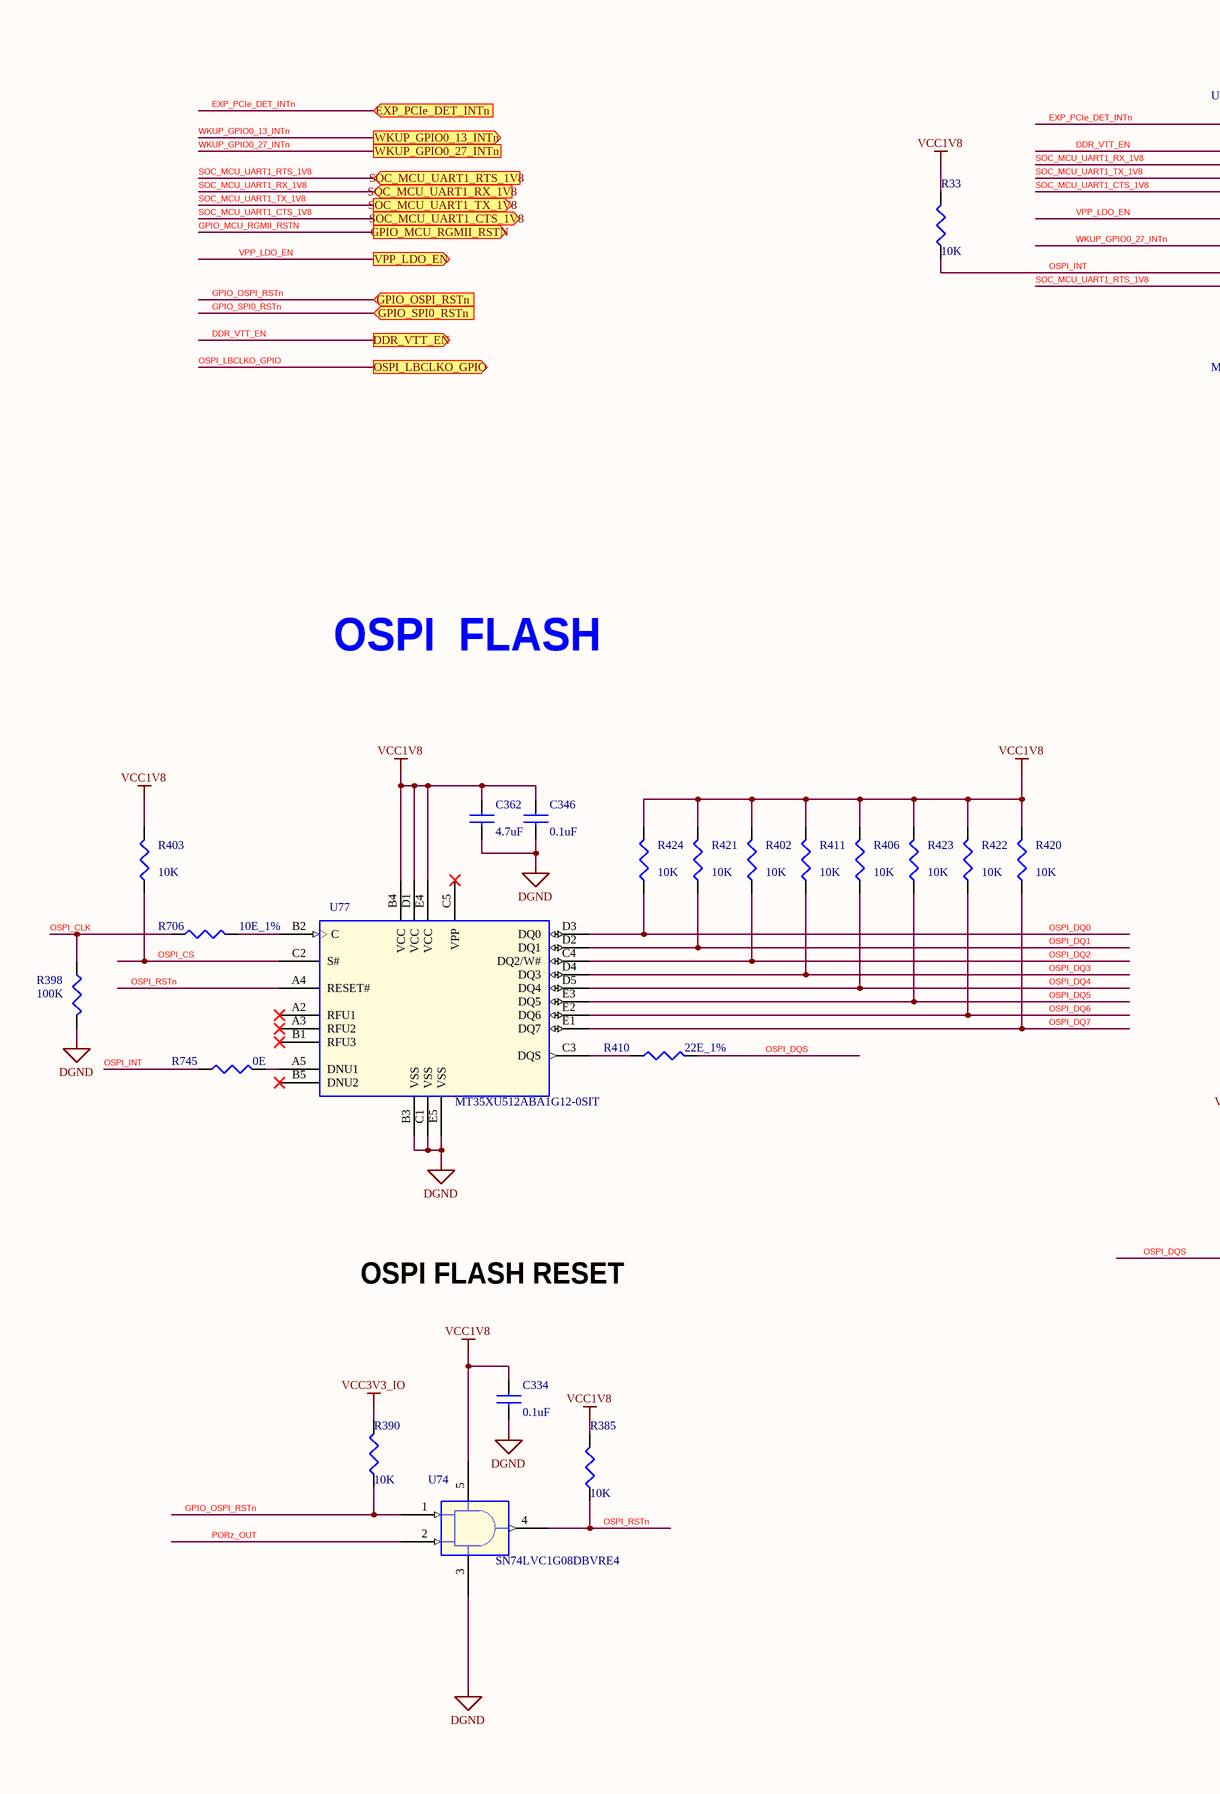
[diagram p28: 18-OSPI FLASH AND SPI NOR FLASH.SchDoc, left]
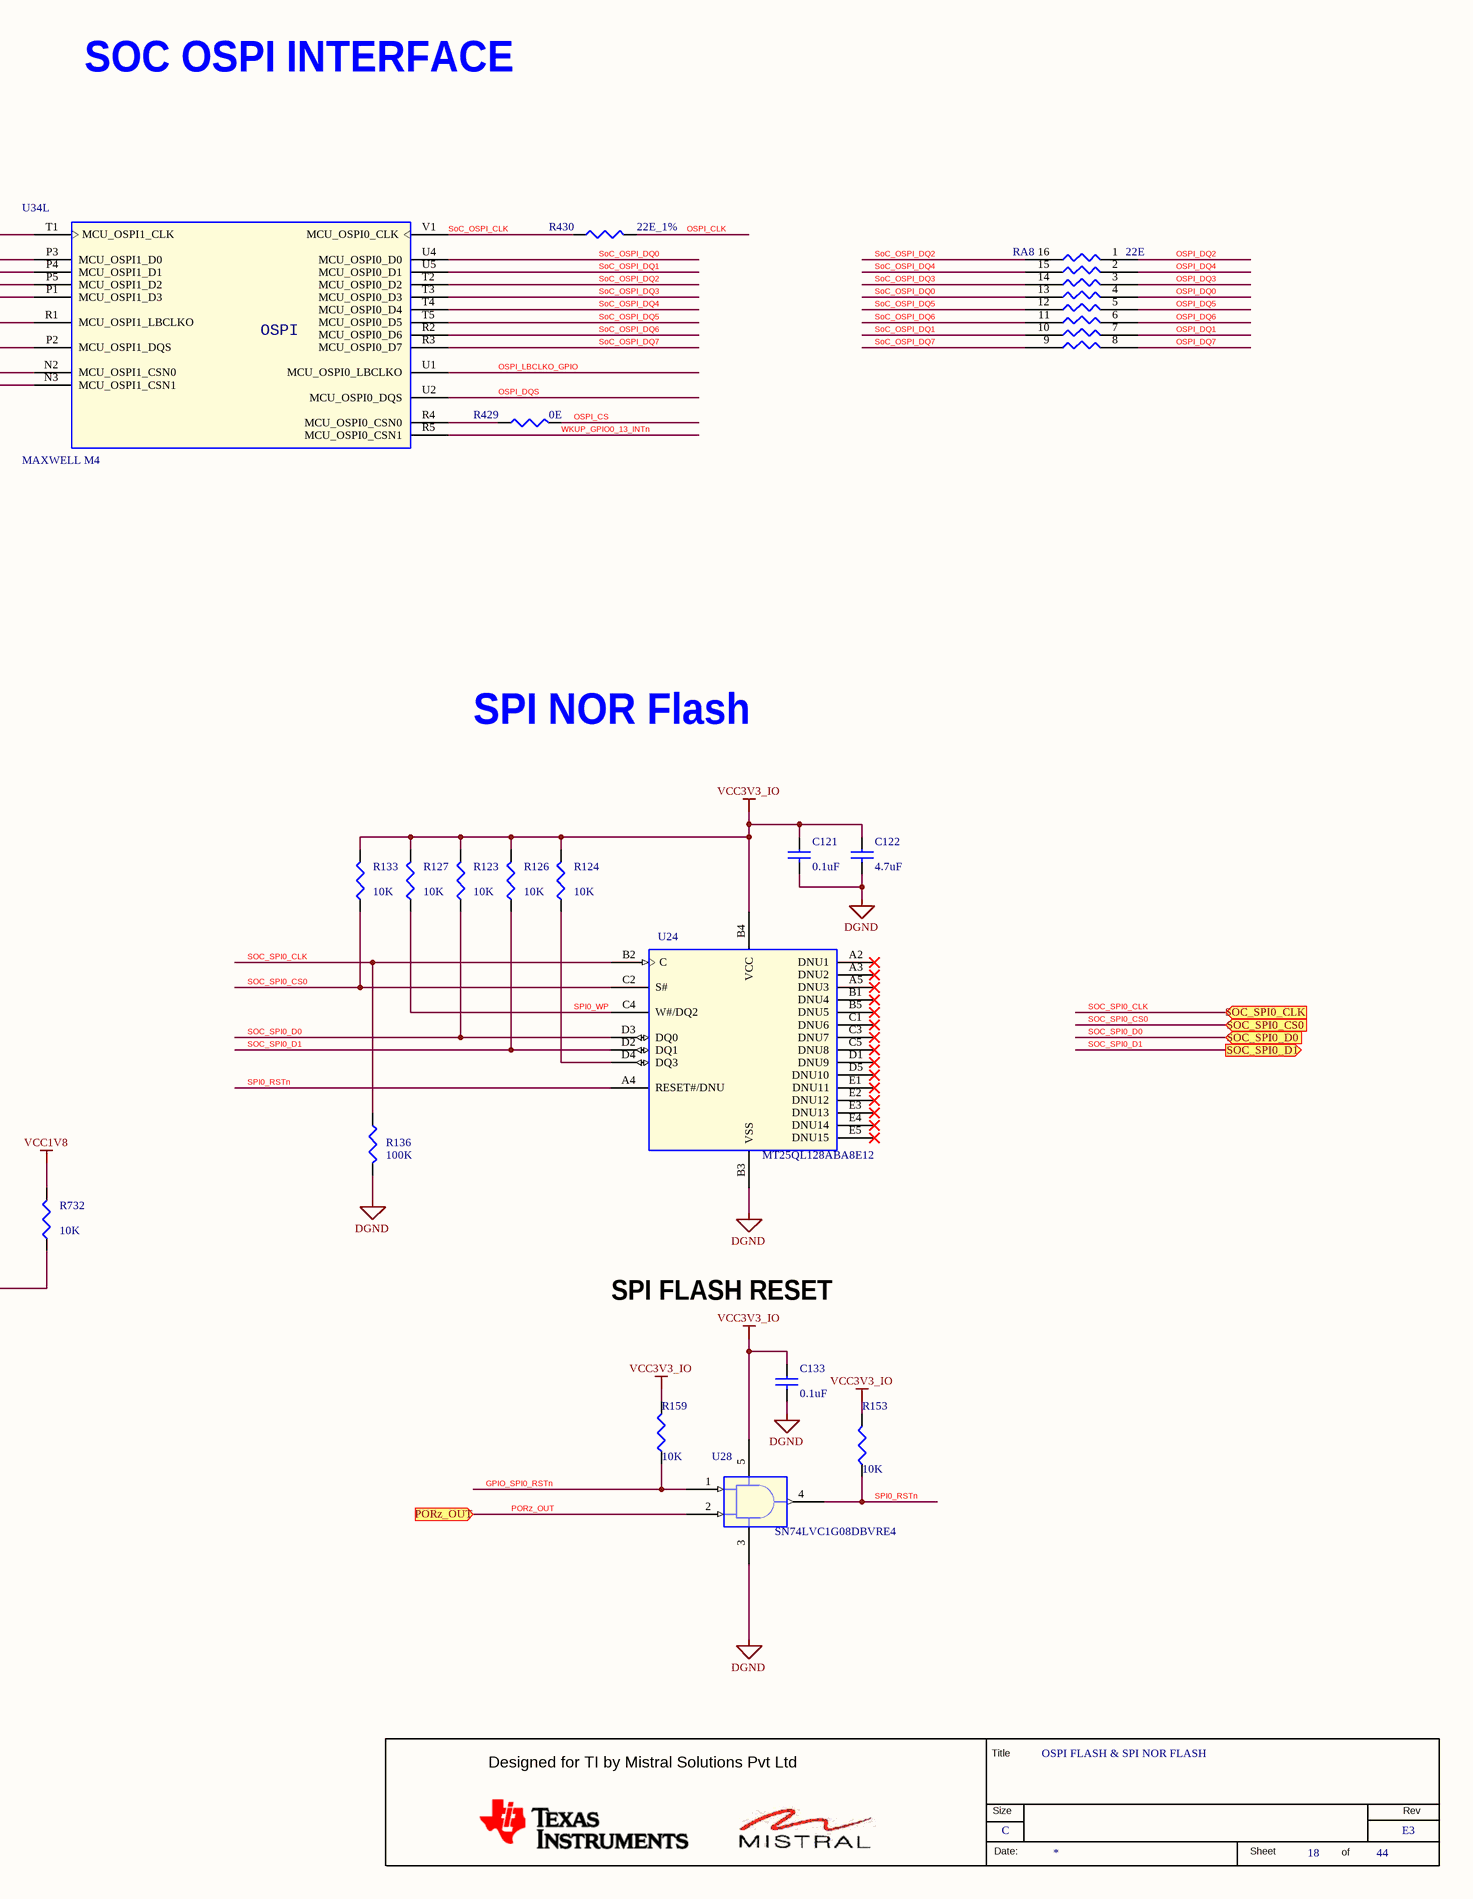
[diagram p29: 18-OSPI FLASH AND SPI NOR FLASH.SchDoc, right]

### Parts
(Parts that share a designator on the sheet are numbered #1, #2 ... from top to bottom, then left to right.)
*#18  RevCode: E3  Title: OSPI FLASH & SPI NOR FLASH  Page Size: C  Page Number: 18  Page Count: 44  (hidden comment: MISTRAL_TITLEBLK_CSIZE)  (graphical)
C121  0.1uF  [CAP0201_0-5]
C122  4.7uF  [CAP0402_0-75]
C133  0.1uF  [CAP0201_0-5]
C334  0.1uF  [CAP0201_0-5]
C346  0.1uF  [CAP0201_0-5]
C362  4.7uF  [CAP0402_0-75]
R33  10K  [RES0402_0-5]
R123  10K  [RES0402_0-5]
R124  10K  [RES0402_0-5]
R126  10K  [RES0402_0-5]
R127  10K  [RES0402_0-5]
R133  10K  [RES0402_0-5]
R136  100K  [RES0402_0-5]
R153  10K  [RES0402_0-5]
R159  10K  [RES0402_0-5]
R385  10K  [RES0402_0-5]
R390  10K  [RES0402_0-5]
R398  100K  [RES0402_0-5]
R402  10K  [RES0402_0-5]
R403  10K  [RES0402_0-5]
R406  10K  [RES0402_0-5]
R410  22E_1%  [RES0402]
R411  10K  [RES0402_0-5]
R420  10K  [RES0402_0-5]
R421  10K  [RES0402_0-5]
R422  10K  [RES0402_0-5]
R423  10K  [RES0402_0-5]
R424  10K  [RES0402_0-5]
R429  0E  [RES0402_0-5]
R430  22E_1%  [RES0402]
R706  10E_1%  [RES0402_0-5]
R732  10K  [RES0402_0-5]
R745  0E  [RES0402_0-5]
RA8  22E  [RESA_0402-8]
U24  MT25QL128ABA8E12  [TPBGA24_39-37_240X320_1-2]
U28  SN74LVC1G08DBVRE4  [SOT23-5]
U34  MAXWELL M4  [BGA784_31-49_910X910_1-7]  (part L of 19)
U74  SN74LVC1G08DBVRE4  [SOT23-5]
U77  MT35XU512ABA1G12-0SIT  [TPBGA24_39-37_240X320_1-2]

### Ports
DDR_VTT_EN (out), EXP_PCIe_DET_INTn (in), GPIO_MCU_RGMII_RSTN (out), GPIO_OSPI_RSTn (in), GPIO_SPI0_RSTn (in), OSPI_LBCLKO_GPIO (out), PORz_OUT (in), SOC_MCU_UART1_CTS_1V8 (out), SOC_MCU_UART1_RTS_1V8 (in), SOC_MCU_UART1_RX_1V8 (in), SOC_MCU_UART1_TX_1V8 (out), SOC_SPI0_CLK (in), SOC_SPI0_CS0 (in), SOC_SPI0_D0 (in), SOC_SPI0_D1 (out), VPP_LDO_EN (out), WKUP_GPIO0_13_INTn (out), WKUP_GPIO0_27_INTn

### Nets
DGND: C121.2 C122.2 C133.2 C334.2 C346.2 C362.2 R136.2 R398.2 U24.B3(VSS) U28.3(GND) U74.3(GND) U77.B3(VSS) U77.C1(VSS) U77.E5(VSS)
VCC1V8: C334.1 C346.1 C362.1 R33.2 R385.2 R402.2 R403.2 R406.2 R411.2 R420.2 R421.2 R422.2 R423.2 R424.2 R732.2 U74.5(VCC) U77.B4(VCC) U77.D1(VCC) U77.E4(VCC)
VCC3V3_IO: C121.1 C122.1 C133.1 R123.2 R124.2 R126.2 R127.2 R133.2 R153.2 R159.2 R390.2 U24.B4(VCC) U28.5(VCC)
DDR_VTT_EN: U34.P3(MCU_OSPI1_D0) ; port DDR_VTT_EN
EXP_PCIe_DET_INTn: U34.T1(MCU_OSPI1_CLK) ; port EXP_PCIe_DET_INTn
GPIO_OSPI_RSTn: R390.1 U74.1(A) ; port GPIO_OSPI_RSTn
GPIO_SPI0_RSTn: R159.1 U28.1(A) ; port GPIO_SPI0_RSTn
OSPI_CLK: R398.1 R430.2 R706.1
OSPI_CS: R403.1 R429.2 U77.C2(S#)
OSPI_DQ0: R424.1 RA8.4 U77.D3(DQ0)
OSPI_DQ1: R421.1 RA8.7 U77.D2(DQ1)
OSPI_DQ2: R402.1 RA8.1 U77.C4(DQ2/W#)
OSPI_DQ3: R411.1 RA8.3 U77.D4(DQ3)
OSPI_DQ4: R406.1 RA8.2 U77.D5(DQ4)
OSPI_DQ5: R423.1 RA8.5 U77.E3(DQ5)
OSPI_DQ6: R422.1 RA8.6 U77.E2(DQ6)
OSPI_DQ7: R420.1 RA8.8 U77.E1(DQ7)
OSPI_DQS: R410.2 R732.1 U34.U2(MCU_OSPI0_DQS)
OSPI_INT: R33.1 R745.1 U34.N2(MCU_OSPI1_CSN0)
OSPI_LBCLKO_GPIO: U34.U1(MCU_OSPI0_LBCLKO) ; port OSPI_LBCLKO_GPIO
OSPI_RSTn: R385.1 U74.4(Y) U77.A4(RESET#)
PORz_OUT: U28.2(B) U74.2(B) ; port PORz_OUT
SOC_MCU_UART1_CTS_1V8: U34.P1(MCU_OSPI1_D3) ; port SOC_MCU_UART1_CTS_1V8
SOC_MCU_UART1_RTS_1V8: U34.N3(MCU_OSPI1_CSN1) ; port SOC_MCU_UART1_RTS_1V8
SOC_MCU_UART1_RX_1V8: U34.P4(MCU_OSPI1_D1) ; port SOC_MCU_UART1_RX_1V8
SOC_MCU_UART1_TX_1V8: U34.P5(MCU_OSPI1_D2) ; port SOC_MCU_UART1_TX_1V8
SoC_OSPI_CLK: R430.1 U34.V1(MCU_OSPI0_CLK)
SoC_OSPI_DQ0: RA8.13 U34.U4(MCU_OSPI0_D0)
SoC_OSPI_DQ1: RA8.10 U34.U5(MCU_OSPI0_D1)
SoC_OSPI_DQ2: RA8.16 U34.T2(MCU_OSPI0_D2)
SoC_OSPI_DQ3: RA8.14 U34.T3(MCU_OSPI0_D3)
SoC_OSPI_DQ4: RA8.15 U34.T4(MCU_OSPI0_D4)
SoC_OSPI_DQ5: RA8.12 U34.T5(MCU_OSPI0_D5)
SoC_OSPI_DQ6: RA8.11 U34.R2(MCU_OSPI0_D6)
SoC_OSPI_DQ7: RA8.9 U34.R3(MCU_OSPI0_D7)
SOC_SPI0_CLK: R136.1 U24.B2(C) ; port SOC_SPI0_CLK
SOC_SPI0_CS0: R133.1 U24.C2(S#) ; port SOC_SPI0_CS0
SOC_SPI0_D0: R123.1 U24.D3(DQ0) ; port SOC_SPI0_D0
SOC_SPI0_D1: R126.1 U24.D2(DQ1) ; port SOC_SPI0_D1
SPI0_RSTn: R153.1 U24.A4(RESET#/DNU) U28.4(Y)
SPI0_WP: R127.1 U24.C4(W#/DQ2)
VPP_LDO_EN: U34.R1(MCU_OSPI1_LBCLKO) ; port VPP_LDO_EN
WKUP_GPIO0_13_INTn: U34.R5(MCU_OSPI0_CSN1) ; port WKUP_GPIO0_13_INTn
WKUP_GPIO0_27_INTn: U34.P2(MCU_OSPI1_DQS) ; port WKUP_GPIO0_27_INTn
NetR124_1: R124.1 U24.D4(DQ3)
NetR410_1: R410.1 U77.C3(DQS)
NetR429_1: R429.1 U34.R4(MCU_OSPI0_CSN0)
NetR706_2: R706.2 U77.B2(C)
NetR745_2: R745.2 U77.A5(DNU1)

Not connected (* = marked no-connect by the designer): U24 A2(DNU1)* A3(DNU2)* A5(DNU3)* B1(DNU4)* B5(DNU5)* C1(DNU6)* C3(DNU7)* C5(DNU8)* D1(DNU9)* D5(DNU10)* E1(DNU11)* E2(DNU12)* E3(DNU13)* E4(DNU14)* E5(DNU15)*; U77 A2(RFU1)* A3(RFU2)* B1(RFU3)* B5(DNU2)* C5(VPP)*

### Notes on the sheet
- SOC OSPI INTERFACE
- OSPI  FLASH
- SPI NOR Flash
- OSPI FLASH RESET
- SPI FLASH RESET
- (in symbol AM654X_BGA784, part L) OSPI
- (in symbol MISTRAL_TITLEBLK_CSIZE) Title; Designed for TI by Mistral Solutions Pvt Ltd; Size; Rev; Date:; Sheet; of

### Library data of the parts
*#18 = MISTRAL_TITLEBLK_CSIZE: Issue: 1.0; Page Create Date: March  8, 1995; Page Modify Date: *
C121 C334 C346 = CAP_Dup5: as C233 on sheet 17-eMMC FLASH_SDCARD INTERFACE; Library Ref: CAP; PCB Footprint: CAP0201_0-5; MECHANICAL 3D STEP FILE: CAP0201_0-5; Chkd/date: MANIRAJA/120218; Crtd /date: MANIRAJA/120218; Datasheet: Y:\MIS_DATABASE\DATASHEETS\CAPACITORS\GRM033R61C104KE84.PDF; Temperature: -55°C+85°C; Weight: 0.33mg; Height: 0.33MM; Distributor_part_number: 490-16742-1-ND; Distributor_name: DIGIKEY; Package: 0201; Voltage: 16V; Tolerance: 10%
C122 = CAP_Dup5: as C695 on sheet 17-eMMC FLASH_SDCARD INTERFACE; Library Ref: CAP; PCB Footprint: CAP0402_0-75; Tolerance: 20%; Voltage: 10V; Package: 0402; Distributor_name: DIGIKEY; Distributor_part_number: 478-10791-1-ND; Height: 0.71MM; Weight: 0.65mg; Temperature: -55°C+85°C; Datasheet: Y:\MIS_DATABASE\DATASHEETS\CAPACITORS\AVX_MLC.PDF; Crtd /date: MANIRAJA/230118; Chkd/date: MANIRAJA/230118; MECHANICAL 3D STEP FILE: CAP0402_0-75
C133 = CAP_Dup5: as C230 on sheet 17-eMMC FLASH_SDCARD INTERFACE; Library Ref: CAP; PCB Footprint: CAP0201_0-5; Tolerance: 10%; Voltage: 16V; Package: 0201; Distributor_name: DIGIKEY; Distributor_part_number: 490-16742-1-ND; Height: 0.33MM; Weight: 0.33mg; Temperature: -55°C+85°C; Datasheet: Y:\MIS_DATABASE\DATASHEETS\CAPACITORS\GRM033R61C104KE84.PDF; Crtd /date: MANIRAJA/120218; Chkd/date: MANIRAJA/120218; MECHANICAL 3D STEP FILE: CAP0201_0-5
C362 = CAP_Dup5: CAP CERAMIC 4.7uF 10V 20% X5R 0402; Part_type: CAPACITORS\CERAMIC; Mfr_part_number: 0402ZD475MAT2A; Mfr_name: AVX CORPORATION; Mistral Part No: 120012060002-R; Custom_Duty: 15%; Customs_HS_Code: 85322990; Wattage: NA; Project: TI_MAXIE_CPB; Library Ref: CAP; PCB Footprint: CAP0402_0-75; MECHANICAL 3D STEP FILE: CAP0402_0-75; Chkd/date: MANIRAJA/230118; Crtd /date: MANIRAJA/230118; Datasheet: Y:\MIS_DATABASE\DATASHEETS\CAPACITORS\AVX_MLC.PDF; Temperature: -55°C+85°C; Weight: 0.65mg; Height: 0.71MM; Distributor_part_number: 478-10791-1-ND; Distributor_name: DIGIKEY; Package: 0402; Voltage: 10V; Tolerance: 20%
R33 R124 R126 R127 R159 R385 R403 = RESISTOR_Dup5: as R516 on sheet 16-DDR4 ECC AND TERMINATIONS; Footprint Path: Y:\MIS_DATABASE\Library\ALTIUM_TOOL\PCB_FOOTPRINTS\Altium_Footprint_Lib.PcbLib; Library Path: Y:\MIS_DATABASE\Library\ALTIUM_TOOL\SCHEMATICS_PARTS\MS_DISCRETE_Library.schlib; Footprint Ref: RES0402_0-5; Library Ref: RESISTOR; PCB Footprint: RES0402_0-5; MECHANICAL 3D STEP FILE: RES0402_0-5; RoHS: Pb-Free; Chkd/date: VASANTHA/061216; Crtd /date: MAZHAR/230805; Datasheet: Y:\MIS_DATABASE\DATASHEETS\RESISTORS\YAGEO-RC0402.PDF; Temperature: -55°C+155°C; Weight: 0.65mg; Height: 0.40MM; Distributor_part_number: 311-10KJRCT-ND; Distributor_name: DIGIKEY; Package: 0402; Wattage: 1/16W; Tolerance: 5%
R123 R133 R153 R390 R402 = RESISTOR_Dup5: as R460 on sheet 16-DDR4 ECC AND TERMINATIONS; Footprint Path: Y:\MIS_DATABASE\Library\ALTIUM_TOOL\PCB_FOOTPRINTS\Altium_Footprint_Lib.PcbLib; Library Path: Y:\MIS_DATABASE\Library\ALTIUM_TOOL\SCHEMATICS_PARTS\MS_DISCRETE_Library.schlib; Footprint Ref: RES0402_0-5; Library Ref: RESISTOR; Tolerance: 5%; Wattage: 1/16W; Package: 0402; Distributor_name: DIGIKEY; Distributor_part_number: 311-10KJRCT-ND; Height: 0.40MM; Weight: 0.65mg; Temperature: -55°C+155°C; Datasheet: Y:\MIS_DATABASE\DATASHEETS\RESISTORS\YAGEO-RC0402.PDF; Crtd /date: MAZHAR/230805; Chkd/date: VASANTHA/061216; RoHS: Pb-Free; MECHANICAL 3D STEP FILE: RES0402_0-5; PCB Footprint: RES0402_0-5
R136 R398 = RESISTOR_Dup4: RES 100K 1/16W 5% 0402; Mistral Part No: 110011060002-R; Mfr_name: VISHAY; Mfr_part_number: CRCW0402100KJNED; Part_type: RESISTORS\FIXED; Project: AM4515_EVM_LCD; Voltage: NA; Customs_HS_Code: 85332119; Custom_Duty: 15%; Library Ref: RESISTOR; Tolerance: 5%; Wattage: 1/16W; Package: 0402; Distributor_name: DIGIKEY; Distributor_part_number: 541-100KJCT-ND; Height: 0.40MM; Weight: 0.65mg; Temperature: -55°C+155°C; Datasheet: Y:\MIS_DATABASE\DATASHEETS\RESISTORS\CRCW0603.PDF; Crtd /date: BAVISH/010611; Chkd/date: VASANTHA/061216; PCB Footprint: RES0402_0-5; MECHANICAL 3D STEP FILE: RES0402_0-5
R406 R420 R423 = RESISTOR_Dup5: as R730 on sheet 16-DDR4 ECC AND TERMINATIONS; Footprint Path: Y:\MIS_DATABASE\Library\ALTIUM_TOOL\PCB_FOOTPRINTS\Altium_Footprint_Lib.PcbLib; Library Path: Y:\MIS_DATABASE\Library\ALTIUM_TOOL\SCHEMATICS_PARTS\MS_DISCRETE_Library.schlib; Footprint Ref: RES0402_0-5; Library Ref: RESISTOR; PCB Footprint: RES0402_0-5; Tolerance: 5%; Wattage: 1/16W; Package: 0402; Distributor_name: DIGIKEY; Distributor_part_number: 311-10KJRCT-ND; Height: 0.40MM; Weight: 0.65mg; Temperature: -55°C+155°C; Datasheet: Y:\MIS_DATABASE\DATASHEETS\RESISTORS\YAGEO-RC0402.PDF; Crtd /date: MAZHAR/230805; Chkd/date: VASANTHA/061216; RoHS: Pb-Free; MECHANICAL 3D STEP FILE: RES0402_0-5
R410 = RESISTOR_Dup4: RES 22E 1/16W 1% 0402; Mistral Part No: 110009090004-P; Mfr_name: YAGEO AMERICA; Mfr_part_number: RC0402FR-0722RL; Part_type: RESISTORS\FIXED; Alternate_mfr_name_A: VISHAY; Alternate_mfr_part_number_A: CRCW040222R0FKED; Cust_part_number: 4700-80047E; SIGNAL_MODEL: RESISTOR_RES0402_22E_22E; Project: VMEFMCD; Voltage: 50V; Customs_HS_Code: 85332119; Custom_Duty: 15%; Remarks: In alternate datasheet it is RoHS COMPLIANT. Y:\MIS_DATABASE\DATASHEETS\RESISTORS\CRCW0402.PDF; Library Ref: RESISTOR; PCB Footprint: RES0402; Tolerance: 1%; Wattage: 1/16W; Package: 0402; Distributor_name: DIGIKEY; Distributor_part_number: 311-22.0LRCT-ND; Distributor_name_A: DIGIKEY; Distributor_part_number_A: 541-22.0LCT-ND; Height: 0.40MM; Weight: 0.8g/1000pcs; Temperature: -55°C+155°C; Datasheet: Y:\MIS_DATABASE\DATASHEETS\RESISTORS\YAGEO-RC0402.PDF; Crtd /date: MAZHAR/090909; Chkd/date: SUHAS/290910; RoHS: Pb-Free
R411 R421 R422 R424 R732 = RESISTOR_Dup5: as R741 on sheet 17-eMMC FLASH_SDCARD INTERFACE; Footprint Path: Y:\MIS_DATABASE\Library\ALTIUM_TOOL\PCB_FOOTPRINTS\Altium_Footprint_Lib.PcbLib; Library Path: Y:\MIS_DATABASE\Library\ALTIUM_TOOL\SCHEMATICS_PARTS\MS_DISCRETE_Library.schlib; Footprint Ref: RES0402_0-5; Library Ref: RESISTOR; PCB Footprint: RES0402_0-5; MECHANICAL 3D STEP FILE: RES0402_0-5; RoHS: Pb-Free; Chkd/date: VASANTHA/061216; Crtd /date: MAZHAR/230805; Datasheet: Y:\MIS_DATABASE\DATASHEETS\RESISTORS\YAGEO-RC0402.PDF; Temperature: -55°C+155°C; Weight: 0.65mg; Height: 0.40MM; Distributor_part_number: 311-10KJRCT-ND; Distributor_name: DIGIKEY; Package: 0402; Wattage: 1/16W; Tolerance: 5%
R429 R745 = RESISTOR_Dup4: RES 0E 1/16W 0402; Mistral Part No: 110010080019-P; Mfr_name: VISHAY; Mfr_part_number: CRCW04020000Z0ED; Part_type: RESISTORS\FIXED; Project: PB_BUGBASE; Tolerance: NA; Customs_HS_Code: 85332119; Custom_Duty: 15%; Footprint Path: Y:\MIS_DATABASE\Library\ALTIUM_TOOL\PCB_FOOTPRINTS\Altium_Footprint_Lib.PcbLib; Library Path: Y:\MIS_DATABASE\Library\ALTIUM_TOOL\SCHEMATICS_PARTS\MS_DISCRETE_Library.schlib; Footprint Ref: RES0402_0-5; Library Ref: RESISTOR; PCB Footprint: RES0402_0-5; Voltage: NA; Wattage: 1/16W; Package: 0402; Distributor_name: DIGIKEY; Distributor_part_number: 541-0.0JCT-ND; Height: 0.40MM; Weight: 0.65g/1000pcs; Temperature: -55°C+155°C; Datasheet: Y:\MIS_DATABASE\DATASHEETS\RESISTORS\CRCW0603.PDF; Crtd /date: MUDDU/190810; Chkd/date: VASANTHA/201216; RoHS: Pb-Free; MECHANICAL 3D STEP FILE: RES0402_0-5
R430 = RESISTOR_Dup4: as R253 on sheet 17-eMMC FLASH_SDCARD INTERFACE; Library Ref: RESISTOR; RoHS: Pb-Free; Chkd/date: SUHAS/290910; Crtd /date: MAZHAR/090909; Datasheet: Y:\MIS_DATABASE\DATASHEETS\RESISTORS\YAGEO-RC0402.PDF; Temperature: -55°C+155°C; Weight: 0.8g/1000pcs; Height: 0.40MM; Distributor_part_number_A: 541-22.0LCT-ND; Distributor_name_A: DIGIKEY; Distributor_part_number: 311-22.0LRCT-ND; Distributor_name: DIGIKEY; Package: 0402; Wattage: 1/16W; Tolerance: 1%; PCB Footprint: RES0402
R706 = RESISTOR_Dup2: RES 10E 1/16W 1% 0402; Part_type: RESISTORS\FIXED; Mfr_part_number: RC0402FR-0710RL; Mfr_name: YAGEO AMERICA; Mistral Part No: 110018020004-R; Custom_Duty: 15%; Customs_HS_Code: 85332119; Project: TI_MAXIE_CPB; Voltage: NA; Library Ref: RESISTOR; PCB Footprint: RES0402_0-5; Chkd/date: MANIRAJA/070218; Crtd /date: ALVY/070218; Datasheet: Y:\MIS_DATABASE\DATASHEETS\RESISTORS\YAGEO-RC0402.PDF; Height: 0.40MM; Distributor_part_number: 311-10.0LRCT-ND; Distributor_name: DIGIKEY; Package: 0402; Wattage: 1/16W; Tolerance: 1%; Weight: 0.65mg; Temperature: -55°C+155°C; MECHANICAL 3D STEP FILE: RES0402_0-5
RA8 = RESARR_ISO8: RES ARRAY 22E 62.5mW 5% 0402; Part_type: RESISTORS\ARRAY; Mfr_part_number: 741X163220JP; Mfr_name: CTS; Mistral Part No: 110009030020-R; Wattage: 63mW; Project: CPB; SIGNAL_MODEL: RESARR_ISO8_RESA_0402-8_22E_22E; Library Ref: RESARR_ISO8; Chkd/date: MAZHAR/040809; Crtd /date: USMAN/040908; Datasheet: Y:\MIS_DATABASE\DATASHEETS\RESISTORS\741-6SER.PDF; Height: 0.55MM; Distributor_part_number: 741X163220JPCT-ND; Distributor_name: DIGIKEY; Package: 0402; Tolerance: 5%; PCB Footprint: RESA_0402-8
U24 = MT25QL02GCBB8E12_TPBGA24: IC 128Mb SERIAL NOR FLASH MEMORY TPBGA24; Mistral Part No: 141117090006-R; Mfr_name: MICRON; Mfr_part_number: MT25QL128ABA8E12-0SIT; Part_type: ICS\DIGITAL\MEMORY; Project: TI_SVB_MAXWELL_FMB; Tolerance: NA; Customs_HS_Code: 85423100; Custom_Duty: 15%; Library Ref: MT25QL02GCBB8E12_TPBGA24; PCB Footprint: TPBGA24_39-37_240X320_1-2; Voltage: NA; Wattage: NA; Package: TPBGA24; Distributor_name: DIGIKEY; Distributor_part_number: MT25QL128ABA8E12-0SIT-ND; Height: 1.20MM; Weight: NA; Temperature: -40°C+85°C; Datasheet: Y:\MIS_DATABASE\DATASHEETS\ICS\MEMORY\MT25QLXXX.PDF; Crtd /date: MANIRAJA/110917; Chkd/date: MANIRAJA/110917; MECHANICAL 3D STEP FILE: TPBGA24_39-37_240X320_1-2
U28 = SN74LVC1G08DBVRE4_SOT23-5: IC SINGLE 2-INPUT POSITIVE AND GATE SOT23-5; Part_type: ICS\DIGITAL\GATES; Mfr_name: TEXAS INSTRUMENTS; Mistral Part No: 141009060026-R; Custom_Duty: 15%; Customs_HS_Code: 85423100; Project: KHAN_MAIN; Library Ref: SN74LVC1G08DBVRE4_SOT23-5; PCB Footprint: SOT23-5; RoHS: Sb/ Br FREE; Chkd/date: SUHAS/221010; Crtd /date: USMAN/151008; Datasheet: Y:\MIS_DATABASE\DATASHEETS\ICS\DIGITAL\GATES\SN74LVC1G08.PDF; Temperature: -40°C+85°C; Height: 1.45MM; Distributor_part_number: SN74LVC1G08DBVRE4-ND; Distributor_name: DIGIKEY; Package: SOT23-5; Mfr_part_number: SN74LVC1G08DBVRE4
U34 = AM654X_BGA784: as U34 on sheet 16-DDR4 ECC AND TERMINATIONS; Library Ref: AM654X_BGA784; Voltage: NA; Wattage: NA; Package: BGA784; Distributor_name: NA; Distributor_part_number: NA; Height: 1.63MM; Weight: NA; Temperature: NA; Datasheet: Y:\MIS_DATABASE\DATASHEETS\ICS\DIGITAL\MICROCONTROLLER\MAXWELLM4.PDF; Crtd /date: MANIRAJA/130717; Chkd/date: MANIRAJA/130717; MECHANICAL 3D STEP FILE: BGA784_31-49_910X910_1-7; PCB Footprint: BGA784_31-49_910X910_1-7
U74 = SN74LVC1G08DBVRE4_SOT23-5: as U48 on sheet 17-eMMC FLASH_SDCARD INTERFACE; Library Ref: SN74LVC1G08DBVRE4_SOT23-5; PCB Footprint: SOT23-5; Mfr_part_number: SN74LVC1G08DBVRE4; Package: SOT23-5; Distributor_name: DIGIKEY; Distributor_part_number: SN74LVC1G08DBVRE4-ND; Height: 1.45MM; Temperature: -40°C+85°C; Datasheet: Y:\MIS_DATABASE\DATASHEETS\ICS\DIGITAL\GATES\SN74LVC1G08.PDF; Crtd /date: USMAN/151008; Chkd/date: SUHAS/221010; RoHS: Sb/ Br FREE
U77 = MT35XU512ABA1G12_TPBGA24: IC 512Mb XCCELA FLASH MEMORY TPBGA24; Part_type: ICS\DIGITAL\MEMORY; Mfr_name: MICRON; Mistral Part No: 141117080009-R; Custom_Duty: 15%; Customs_HS_Code: 85423100; Wattage: NA; Project: TI_MAXIE_CPB; MECHANICAL 3D STEP FILE: TPBGA24_39-37_240X320_1-2; Chkd/date: MANIRAJA/240817; Crtd /date: MANIRAJA/240817; Datasheet: Y:\MIS_DATABASE\DATASHEETS\ICS\MEMORY\MT35XU5XX.PDF; Temperature: -40°C+85°C; Weight: NA; Height: 1.20MM; Distributor_part_number: NA; Distributor_name: NA; Package: TPBGA24; Voltage: NA; Tolerance: NA; Mfr_part_number: MT35XU512ABA1G12-0SIT; Library Ref: MT35XU512ABA1G12_TPBGA24; PCB Footprint: TPBGA24_39-37_240X320_1-2